# Altium schematic sheet 000.000.000Э3 Контроллер табло.SchDoc
size 594 x 420 mm; Zam._gl._konstr._po_konctr._chasti: {Фамилия}; Zakaz: {Заказ}; Zam._gl._konstr._po_shemnoi_chasti: {Инженер}; ApprovedBy: Тучков; DrawnBy: Выродов; DocumentNumber: 000.000.000Э3; SheetTotal: 1; PageSetup: Record=PageOptions|CenterHorizontal=False|CenterVertical=False|PrintScale=0.33|XCorrection=0.00|YCorrection=0.00|PrintKind=1|BorderSize=5000000|LeftOffset=0|BottomOffset=0|Orientation=1|PaperLength=1000|PaperWidth=1000|Scale=100|PaperSource=15|PrintQuality=600|MediaType=1|DitherType=10|PaperKind=A4|PrintScaleMode=1; ImagePath: 000.000.000; Rule: PcbType=ProtelPcb
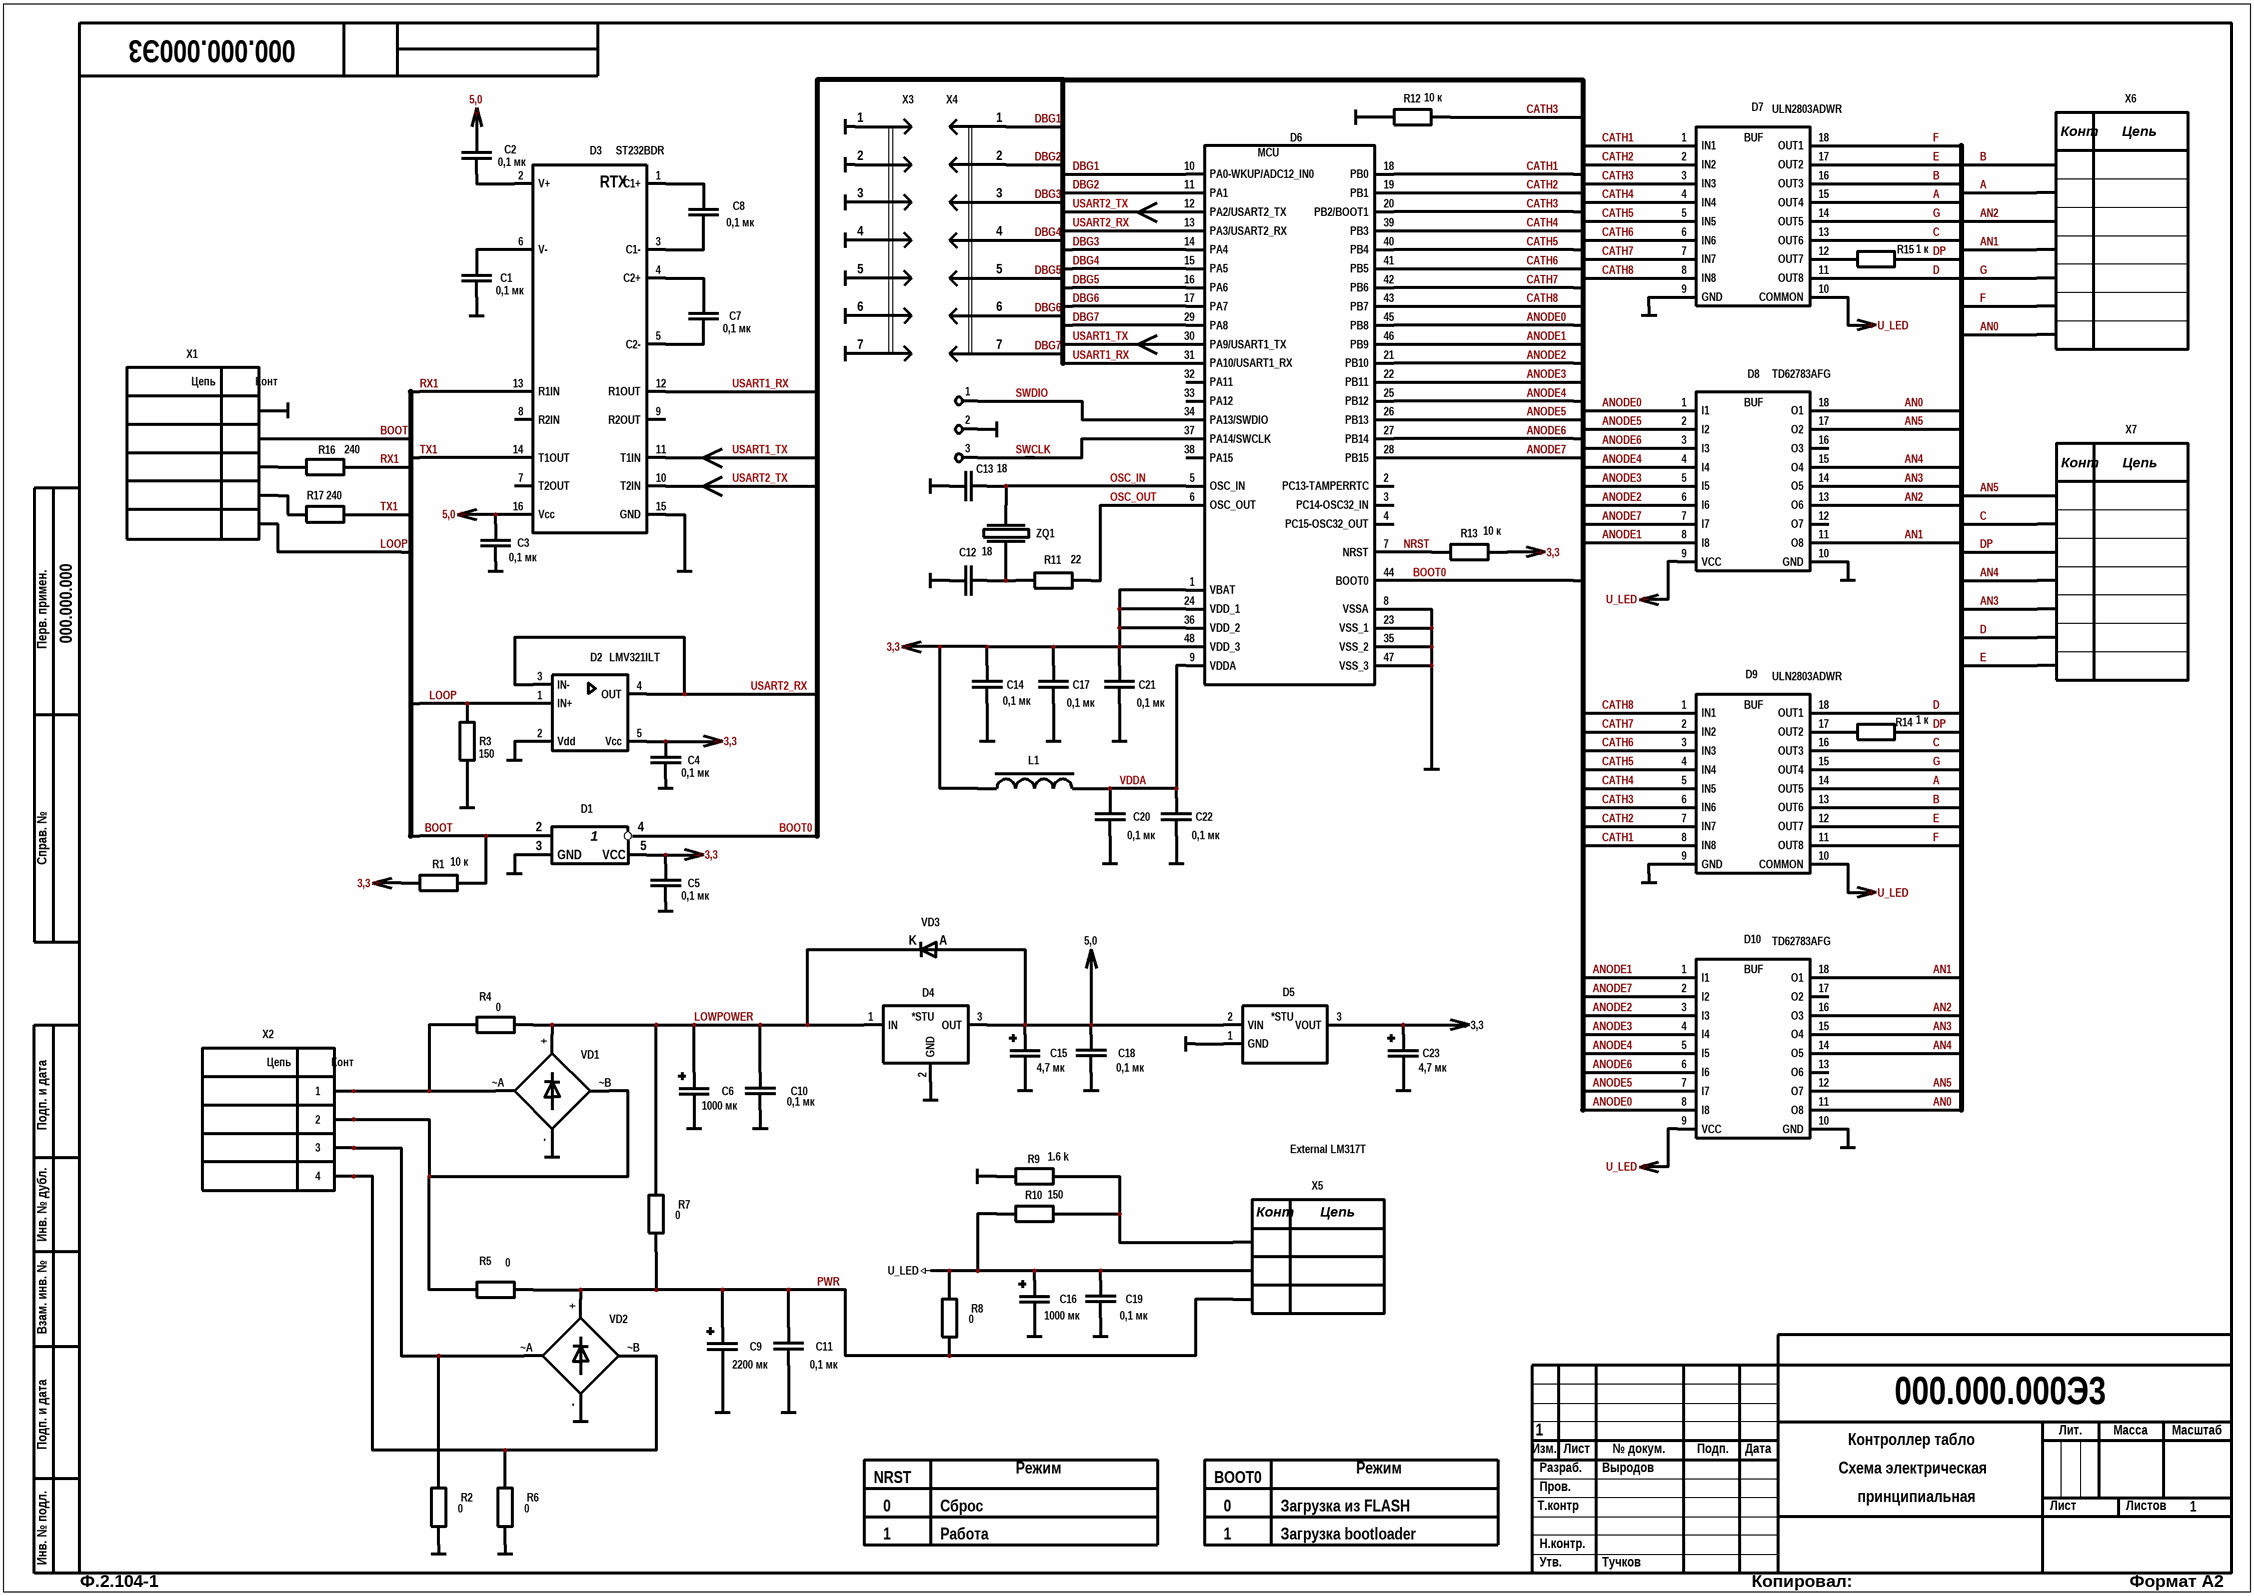
[diagram p0: 000.000.000Э3 Контроллер табло.SchDoc]

## Parts
(Parts that share a designator on the sheet are numbered #1, #2 ... from top to bottom, then left to right.)
1  (no value)  [PADROUND]  (no BOM)
2  (no value)  [PADROUND]  (no BOM)
3  (no value)  [PADROUND]  (no BOM)
*  Arrow signal  (value not drawn)  (graphical)
*?#1  (no value)  (graphical)
*?#2  GND  (value not drawn)  (graphical)
*?#3  GND  (value not drawn)  (graphical)
*?#4  GND  (value not drawn)  (graphical)
*?#5  GND  (value not drawn)  (graphical)
*?#6  Arrow signal  (value not drawn)  (graphical)
*?#7  GND  (value not drawn)  (graphical)
*?#8  GND  (value not drawn)  (graphical)
*?#9  GND  (value not drawn)  (graphical)
*?#10  GND  (value not drawn)  (graphical)
*?#11  GND  (value not drawn)  (graphical)
*?#12  (no value)  (graphical)
*?#13  Arrow signal  (value not drawn)  (graphical)
*?#14  GND  (value not drawn)  (graphical)
*?#15  GND  (value not drawn)  (graphical)
*?#16  GND  (value not drawn)  (graphical)
*?#17  Arrow signal  (value not drawn)  (graphical)
*?#18  GND  (value not drawn)  (graphical)
*?#19  (no value)  (graphical)
*?#20  (no value)  (graphical)
*?#21  GND  (value not drawn)  (graphical)
*?#22  GND  (value not drawn)  (graphical)
*?#23  GND  (value not drawn)  (graphical)
*?#24  GND  (value not drawn)  (graphical)
*?#25  (no value)  (graphical)
*?#26  (no value)  (graphical)
*?#27  GND  (value not drawn)  (graphical)
*?#28  GND  (value not drawn)  (graphical)
*?#29  GND  (value not drawn)  (graphical)
*?#30  (no value)  (graphical)
*?#31  GND  (value not drawn)  (graphical)
*?#32  GND  (value not drawn)  (graphical)
*?#33  GND  (value not drawn)  (graphical)
*?#34  GND  (value not drawn)  (graphical)
*?#35  (no value)  (graphical)
*?#36  GND  (value not drawn)  (graphical)
*?#37  GND  (value not drawn)  (graphical)
*?#38  GND  (value not drawn)  (graphical)
*?#39  GND  (value not drawn)  (graphical)
*?#40  (no value)  (graphical)
*?#41  (no value)  (graphical)
*?#42  GND  (value not drawn)  (graphical)
*?#43  (no value)  (graphical)
*?#44  (no value)  (graphical)
*?#45  GND  (value not drawn)  (graphical)
*?#46  GND  (value not drawn)  (graphical)
*?#47  GND  (value not drawn)  (graphical)
*?#48  GND  (value not drawn)  (graphical)
*?#49  GND  (value not drawn)  (graphical)
*?#50  GND  (value not drawn)  (graphical)
*?#51  GND  (value not drawn)  (graphical)
*?#52  GND  (value not drawn)  (graphical)
*?#53  GND  (value not drawn)  (graphical)
*?#54  (no value)  (graphical)
*?#55  GND  (value not drawn)  (graphical)
*?#56  GND  (value not drawn)  (graphical)
*?#57  GND  (value not drawn)  (graphical)
*?#58  GND  (value not drawn)  (graphical)
*?#59  GND  (value not drawn)  (graphical)
*?#60  GND  (value not drawn)  (graphical)
*?#61  GND  (value not drawn)  (graphical)
*?#62  GND  (value not drawn)  (graphical)
C1  Visible: 0,1 мк  [CAP0805-125]  (hidden comment: GRM21BR71H104KA01L (0805 X7R 0,1 мкФ ±10% 50 В))
C2  Visible: 0,1 мк  [CAP0805-125]  (hidden comment: GRM21BR71H104KA01L (0805 X7R 0,1 мкФ ±10% 50 В))
C3  Visible: 0,1 мк  [CAP0805-125]  (hidden comment: GRM21BR71E105KA99L (0805 X7R 1 мкФ ±10% 25 В))
C4  Visible: 0,1 мк  [CAP0805-125]  (hidden comment: GRM21BR71H104KA01L (0805 X7R 0,1 мкФ ±10% 50 В))
C5  Visible: 0,1 мк  [CAP0805-125]  (hidden comment: GRM21BR71H104KA01L (0805 X7R 0,1 мкФ ±10% 50 В))
C6  Visible: 1000 мк  [CAPR10x21]  (hidden comment: WLR102M1EG21 (1000 мкФ 25 В 10х21))
C7  Visible: 0,1 мк  [CAP0805-125]  (hidden comment: GRM21BR71H104KA01L (0805 X7R 0,1 мкФ ±10% 50 В))
C8  Visible: 0,1 мк  [CAP0805-125]  (hidden comment: GRM21BR71H104KA01L (0805 X7R 0,1 мкФ ±10% 50 В))
C9  Visible: 2200 мк  [CAPR16x25]  (hidden comment: TKR222M1VK25 (2200 мкФ 35 В 16х25))
C10  Visible: 0,1 мк  [JFA11x13x7.5]  (hidden comment: JFA02A104J (0,1 мкФ, 100 В, 5%))
C11  Visible: 0,1 мк  [JFA11x13x7.5]  (hidden comment: JFA02A104J (0,1 мкФ, 100 В, 5%))
C12  Visible: 18  [CAP0805-060_NP0]  (hidden comment: GRM2165C1H180JD01D (0805 NP0 18 пФ ±5% 50 В))
C13  Visible: 18  [CAP0805-060_NP0]  (hidden comment: GRM2165C1H180JD01D (0805 NP0 18 пФ ±5% 50 В))
C14  Visible: 0,1 мк  [CAP0805-125]  (hidden comment: GRM21BR71H104KA01L (0805 X7R 0,1 мкФ ±10% 50 В))
C15  Visible: 4,7 мк  [3216-18]  (hidden comment: TECAP4.7/10VA10 ( тип А 4,7 мкФ 10 В ±10%))
C16  Visible: 1000 мк  [CAPR10x21]  (hidden comment: WLR102M1EG21 (1000 мкФ 25 В 10х21))
C17  Visible: 0,1 мк  [CAP0805-125]  (hidden comment: GRM21BR71H104KA01L (0805 X7R 0,1 мкФ ±10% 50 В))
C18  Visible: 0,1 мк  [JFA11x13x7.5]  (hidden comment: JFA02A104J (0,1 мкФ, 100 В, 5%))
C19  Visible: 0,1 мк  [JFA11x13x7.5]  (hidden comment: JFA02A104J (0,1 мкФ, 100 В, 5%))
C20  Visible: 0,1 мк  [CAP0805-125]  (hidden comment: GRM21BR71E105KA99L (0805 X7R 1 мкФ ±10% 25 В))
C21  Visible: 0,1 мк  [CAP0805-125]  (hidden comment: GRM21BR71H104KA01L (0805 X7R 0,1 мкФ ±10% 50 В))
C22  Visible: 0,1 мк  [CAP0805-125]  (hidden comment: GRM21BR71H104KA01L (0805 X7R 0,1 мкФ ±10% 50 В))
C23  Visible: 4,7 мк  [3216-18]  (hidden comment: TECAP4.7/10VA10 ( тип А 4,7 мкФ 10 В ±10%))
D1  SN74AHC1G14DRLR  [SOT23-5]  (value not drawn)
D2  LMV321ILT  [SOT23-5]
D3  ST232BDR  [SO16_N]
D4  L78M05ABDT-TR  [D2PAK]  (value not drawn)
D5  MC78LC33NTRG  [SOT23-5]  (value not drawn)
D6  STM32F103C8T6  [LQFP-48]  (value not drawn)
D7  ULN2803ADWR  [SOP-18]
D8  TD62783AFG  [SOP-18]
D9  ULN2803ADWR  [SOP-18]
D10  TD62783AFG  [SOP-18]
L1  LQM21PN4R7NGR (0805 4,7 мкГн 0,8 А 288 мОм)  [LQM21-G]  (value not drawn)
R1  Visible: 10 к  [RES0805-050]  (hidden comment: RC0805FR-0710KL (0805 10 кОм ±1%))
R2  Visible: 0  [RES2512-055]  (hidden comment: RC2512FR-070RL (1206 0 Ом))
R3  Visible: 150  [RES0805-050]  (hidden comment: RC0805FR-07150RL (0805 150 Ом ±1%))
R4  Visible: 0  [RES2512-055]  (hidden comment: RC2512FR-070RL (1206 0 Ом))
R5  Visible: 0  [RES2512-055]  (hidden comment: RC2512FR-070RL (1206 0 Ом))
R6  Visible: 0  [RES2512-055]  (hidden comment: RC2512FR-070RL (1206 0 Ом))
R7  Visible: 0  [RES2512-055]  (hidden comment: RC2512FR-070RL (1206 0 Ом))
R8  Visible: 0  [RES2512-055]  (hidden comment: RC2512FR-070RL (1206 0 Ом))
R9  Visible: 1.6 k  [RES0805-050]  (hidden comment: RC0805FR-071K6L (0805 1,6 кОм ±1))
R10  Visible: 150  [RES0805-050]  (hidden comment: RC0805FR-07150RL (0805 150 Ом ±1%))
R11  Visible: 22  [RES0805-050]  (hidden comment: RC0805JR-0722R (0805 22 Ом ±5%))
R12  Visible: 10 к  [RES0805-050]  (hidden comment: RC0805FR-0710KL (0805 10 кОм ±1%))
R13  Visible: 10 к  [RES0805-050]  (hidden comment: RC0805FR-0710KL (0805 10 кОм ±1%))
R14  Visible: 1 к  [RES1206-055]  (hidden comment: RC1206FR-071KL (1206 1 кОм ±1%))
R15  Visible: 1 к  [RES1206-055]  (hidden comment: RC1206FR-071KL (1206 1 кОм ±1%))
R16  Visible: 240  [RES0805-050]  (hidden comment: RC0805FR-07240RL (0805 240 Ом ±1%))
R17  Visible: 240  [RES0805-050]  (hidden comment: RC0805FR-07240RL (0805 240 Ом ±1%))
VD1  2W10G-E4/51  [2W10]  (value not drawn)
VD2  2W10G-E4/51  [2W10]  (value not drawn)
VD3  S1G  [DO-214AA]  (value not drawn)
X1  DS1070-5MVV6 (WF-05)  [WF-05]  (value not drawn)
X2  DS1072-4MVT6 (PWL-4)  [PWL-4]  (value not drawn)
X3  Соединитель штыревой PLS-7  [PLS-2.54-7]  (value not drawn)
X4  Соединитель штыревой PLS-7  [PLS-2.54-7]  (value not drawn)
X5  Connector 3  [WF-03]  (value not drawn)
X6  (no value)  [WF-07]
X7  (no value)  [WF-07]
ZQ1  8.000MHzHC-49US  [KX-3H_spacer]  (value not drawn)

## Nets
3,3: C4.2 C5.2 C14.2 C17.2 C21.2 C23.1 D1.5(VCC) D2.5(Vcc) D5.3(VOUT) D6.1(VBAT) D6.24(VDD_1) D6.36(VDD_2) D6.48(VDD_3) L1.1 R1.1 R13.2
5,0: C2.2 C3.2 C15.1 C18.2 D3.16(Vcc) D4.3(OUT) D5.2(VIN) VD3.A
GND: 2.1 C1.1 C3.1 C4.1 C5.1 C6.2 C9.2 C10.1 C11.1 C12.2 C13.2 C14.1 C15.2 C16.2 C17.1 C18.1 C19.1 C20.1 C21.1 C22.1 C23.2 D1.3(GND) D2.2(Vdd) D3.15(GND) D4.2(GND) D5.1(GND) D6.8(VSSA) D6.23(VSS_1) D6.35(VSS_2) D6.47(VSS_3) D7.9(GND) D8.10(GND) D9.9(GND) D10.10(GND) R2.1 R3.2 R6.1 R9.1 R12.2 VD1.- VD2.- X1.1 X3.1 X3.2 X3.3 X3.4 X3.5 X3.6 X3.7
U_LED: C16.1 C19.2 D7.10(COMMON) D8.9(VCC) D9.10(COMMON) D10.9(VCC) R8.2 R10.1 X5.2
A: D7.15(OUT4) D9.14(OUT5) X6.2
AN0: D8.18(O1) D10.11(O8) X6.7
AN1: D8.11(O8) D10.18(O1) X6.4
AN2: D8.13(O6) D10.16(O3) X6.3
AN3: D8.14(O5) D10.15(O4) X7.5
AN4: D8.15(O4) D10.14(O5) X7.4
AN5: D8.17(O2) D10.12(O7) X7.1
ANODE0: D6.45(PB8) D8.1(I1) D10.8(I8)
ANODE1: D6.46(PB9) D8.8(I8) D10.1(I1)
ANODE2: D6.21(PB10) D8.6(I6) D10.3(I3)
ANODE3: D6.22(PB11) D8.5(I5) D10.4(I4)
ANODE4: D6.25(PB12) D8.4(I4) D10.5(I5)
ANODE5: D6.26(PB13) D8.2(I2) D10.7(I7)
ANODE6: D6.27(PB14) D8.3(I3) D10.6(I6)
ANODE7: D6.28(PB15) D8.7(I7) D10.2(I2)
B: D7.16(OUT3) D9.13(OUT6) X6.1
BOOT: D1.2 R1.2 X1.2
BOOT0: D1.4 D6.44(BOOT0)
C: D7.13(OUT6) D9.16(OUT3) X7.2
CATH1: D6.18(PB0) D7.1(IN1) D9.8(IN8)
CATH2: D6.19(PB1) D7.2(IN2) D9.7(IN7)
CATH3: D6.20(PB2/BOOT1) D7.3(IN3) D9.6(IN6) R12.1
CATH4: D6.39(PB3) D7.4(IN4) D9.5(IN5)
CATH5: D6.40(PB4) D7.5(IN5) D9.4(IN4)
CATH6: D6.41(PB5) D7.6(IN6) D9.3(IN3)
CATH7: D6.42(PB6) D7.7(IN7) D9.2(IN2)
CATH8: D6.43(PB7) D7.8(IN8) D9.1(IN1)
D: D7.11(OUT8) D9.18(OUT1) X7.6
DBG1: D6.10(PA0-WKUP/ADC12_IN0) X4.1
DBG2: D6.11(PA1) X4.2
DBG3: D6.14(PA4) X4.3
DBG4: D6.15(PA5) X4.4
DBG5: D6.16(PA6) X4.5
DBG6: D6.17(PA7) X4.6
DBG7: D6.29(PA8) X4.7
DP: R14.2 R15.2 X7.3
E: D7.17(OUT2) D9.12(OUT7) X7.7
F: D7.18(OUT1) D9.11(OUT8) X6.6
G: D7.14(OUT5) D9.15(OUT4) X6.5
LOOP: D2.1(IN+) R3.1 X1.5
LOWPOWER: C6.1 C10.2 D4.1(IN) R4.1 R7.2 VD1.+ VD3.K
NRST: D6.7(NRST) R13.1
OSC_IN: C13.1 D6.5(OSC_IN) ZQ1.1
OSC_OUT: D6.6(OSC_OUT) R11.1
PWR: C9.1 C11.2 R5.1 R7.1 R8.1 VD2.+ X5.3
RX1: D3.13(R1IN) R16.2
SWCLK: 3.1 D6.37(PA14/SWCLK)
SWDIO: 1.1 D6.34(PA13/SWDIO)
TX1: D3.14(T1OUT) R17.2
USART1_RX: D3.12(R1OUT) D6.31(PA10/USART1_RX)
USART1_TX: D3.11(T1IN) D6.30(PA9/USART1_TX)
USART2_RX: D2.3(IN-) D2.4(OUT) D6.13(PA3/USART2_RX)
USART2_TX: D3.10(T2IN) D6.12(PA2/USART2_TX)
VDDA: C20.2 C22.2 D6.9(VDDA) L1.2
NetC1_2: C1.2 D3.6(V-)
NetC2_1: C2.1 D3.2(V+)
NetC7_1: C7.1 D3.5(C2-)
NetC7_2: C7.2 D3.4(C2+)
NetC8_1: C8.1 D3.3(C1-)
NetC8_2: C8.2 D3.1(C1+)
NetC12_1: C12.1 R11.2 ZQ1.2
NetD7_12: D7.12(OUT7) R15.1
NetD9_17: D9.17(OUT2) R14.1
NetR2_2: R2.2 VD2.~A X2.3
NetR4_2: R4.2 VD1.~A X2.1
NetR5_2: R5.2 VD1.~B X2.2
NetR6_2: R6.2 VD2.~B X2.4
NetR9_2: R9.2 R10.2 X5.1
NetR16_1: R16.1 X1.3
NetR17_1: R17.1 X1.4

Not connected (* = marked no-connect by the designer): D3 7(T2OUT) 8(R2IN) 9(R2OUT); D6 2(PC13-TAMPERRTC) 3(PC14-OSC32_IN) 4(PC15-OSC32_OUT) 32(PA11) 33(PA12) 38(PA15); D8 12(O7) 16(O3); D10 13(O6) 17(O2)

## Notes on the sheet
- External LM317T
- 1
- Контроллер табло
- NRST
- 0
- Сброс
- Режим
- BOOT0
- Загрузка из FLASH
- Схема электрическая
- принципиальная
- Работа
- Загрузка bootloader
- Перв. примен.
- Справ. №
- Подп. и дата
- Инв. № дубл.
- Взам. инв. №
- Изм.
- Лист
- № докум.
- Подп.
- Дата
- Лит.
- Масса
- Масштаб
- Т.контр
- Пров.
- Разраб.
- Листов
- Инв. № подл.
- Н.контр.
- Ф.2.104-1
- Утв.
- Копировал:
- Формат А2
- (in symbol Connector 3) Конт; Цепь
- (in symbol Connector 4) Цепь; Конт
- (in symbol Connector 5) Цепь; Конт
- (in symbol Connector_7) Конт; Цепь
- (in symbol LM7805CV) *STU
- (in symbol MC78LC00) *STU
- (in symbol SN74AHC1G14DRLR) 1
- (in symbol ST232BDR) RTX
- (in symbol STM32F103C8T6) MCU
- (in symbol ULN2803) BUF
- (in symbol UTC62783) BUF

## Library data of the parts
1-3 = Point
*?#1 *?#12 *?#19 *?#20 *?#25 *?#26 *?#30 *?#35 *?#40 *?#41 *?#43 *?#44 *?#54 = Arrow power
C1-C5 C7 C8 C10-C14 C17-C22 = Capacitor
  C1 C2 C4 C5 C7 C8 C14 C17 C21 C22: Value: GRM21BR71H104KA01L (0805 X7R 0,1 мкФ ±10% 50 В); Cost: 7
  C3 C20: Value: GRM21BR71E105KA99L (0805 X7R 1 мкФ ±10% 25 В); Cost: 7
  C10 C11 C18 C19: Value: JFA02A104J (0,1 мкФ, 100 В, 5%); Cost: 6
  C12 C13: Value: GRM2165C1H180JD01D (0805 NP0 18 пФ ±5% 50 В); Cost: 6
C6 C9 C15 C16 C23 = CAP_POL
  C6 C16: Value: WLR102M1EG21 (1000 мкФ 25 В 10х21); Cost: 16
  C9: Value: TKR222M1VK25 (2200 мкФ 35 В 16х25); Cost: 40
  C15 C23: Value: TECAP4.7/10VA10 ( тип А 4,7 мкФ 10 В ±10%); Cost: 8
D1 = SN74AHC1G14DRLR: Value: SN74LVC1G04DBVR; Cost: 6
D4 = LM7805CV: Value: L78M05ABDT-TR; Cost: 15
D5 = MC78LC00: Value: MC78LC33NTRG
D7 D9 = ULN2803: Value: ULN2803ADWR; Cost: 55
D8 D10 = UTC62783: Value: TD62783AFG; Cost: 47
L1 = L: Value: LQM21PN4R7NGR (0805 4,7 мкГн 0,8 А 288 мОм); Cost: 14; Visible: 4,7 мкГн
R1-R17 = Resistor
  R1 R12 R13: Value: RC0805FR-0710KL (0805 10 кОм ±1%); Cost: 0.9
  R2 R4-R8: Value: RC2512FR-070RL (1206 0 Ом); Cost: 0,9
  R3 R10: Value: RC0805FR-07150RL (0805 150 Ом ±1%); Cost: 0.9
  R9: Value: RC0805FR-071K6L (0805 1,6 кОм ±1); Cost: 0,9
  R11: Value: RC0805JR-0722R (0805 22 Ом ±5%); Cost: 0.9
  R14 R15: Value: RC1206FR-071KL (1206 1 кОм ±1%); Cost: 0.8
  R16 R17: Value: RC0805FR-07240RL (0805 240 Ом ±1%); Cost: 0.9
VD1 VD2 = Diode bridge: Diode; Value: 2W10G-E4/51; Cost: 27
VD3 = Diode: Value: S1G; Cost: 3
X1 = Connector 5: Value: DS1070-5MVV6 (WF-05); Cost: 6
X2 = Connector 4: Value: DS1072-4MVT6 (PWL-4); Cost: 6; Visible: *
X3 X4 = PLS-7: Value: Соединитель штыревой PLS-7
X5 = Connector 3: Value: DS1070-3MVV6 (WF-03); Cost: 5
X6 X7 = Connector_7: Value: DS1070-7MVV6 (WF-7); Cost: 6
ZQ1 = Quartz: Value: 8.000MHzHC-49US; Cost: 15
D2 = LMV321ILT: Value: LMV321ILT; Cost: 14
D3 = ST232BDR: Value: ST232BDR; Cost: 22
D6 = STM32F103C8T6: Value: STM32F103C8T6; Cost: 220